# Altium schematic sheet Main.SchDoc: Breakout 12pin
size A3; Organization: INTERCREATE; Address1: 2415 3RD ST. SUITE #232; Address2: SAN FRANCISCO CA 94107; SheetNumber: 1; SheetTotal: 1; ProjectName: KAGWERKS COMMAND CENTER
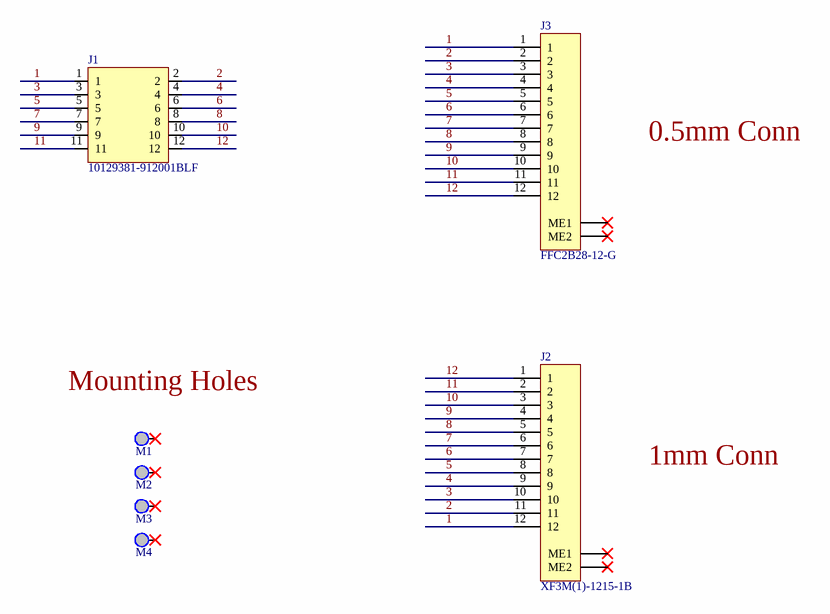
[diagram p0: Main.SchDoc]

## Parts
J1  10129381-912001BLF  [HDR-V-2X6-2.54MM]
J2  XF3M(1)-1215-1B  [CONN-FFC-H-12P-1MM]
J3  FFC2B28-12-G  [CONN-FFC-H-12P-0.5MM]
M1  MTG_HOLE  [MH_P_2.5MM]  (value not drawn)  (no BOM)
M2  MTG_HOLE  [MH_P_2.5MM]  (value not drawn)  (no BOM)
M3  MTG_HOLE  [MH_P_2.5MM]  (value not drawn)  (no BOM)
M4  MTG_HOLE  [MH_P_2.5MM]  (value not drawn)  (no BOM)

## Nets
1: J1.1 J2.12 J3.1
2: J1.2 J2.11 J3.2
3: J1.3 J2.10 J3.3
4: J1.4 J2.9 J3.4
5: J1.5 J2.8 J3.5
6: J1.6 J2.7 J3.6
7: J1.7 J2.6 J3.7
8: J1.8 J2.5 J3.8
9: J1.9 J2.4 J3.9
10: J1.10 J2.3 J3.10
11: J1.11 J2.2 J3.11
12: J1.12 J2.1 J3.12

Not connected (* = marked no-connect by the designer): J2 ME1* ME2*; J3 ME1* ME2*; M1 1*; M2 1*; M3 1*; M4 1*

## Notes on the sheet
- 0.5mm Conn
- (near M1) Mounting Holes
- 1mm Conn
- Title
- Size:
- Date:
- A3
- Number:
- Time:
- Revision:
- Sheet
- of
- File:

## Library data of the parts
J1 = HDR-V-2X6-M-2.54MM: Conn Unshrouded Header HDR 12 POS 2.54mm Solder ST Thru-Hole Poly Bag; Manufacturer 1: Amphenol ICC / FCI; Supplier: Arrow Electronics; Supplier Part Number: 10129381-912001BLF; Manufacturer Part Number 1: 10129381-912001BLF; RoHS: No; Category: Connectors; Stock: 1680; Pricing: 1=0.15, 10=0.1167, 25=0.1155, 50=0.1143, 100=0.0928, 500=0.0794 (USD)
J2 = CONN-FFC-H-12P-1MM: FFC & FPC Connectors RotaryBackLock 1.0mm Dual Contact 12pin; Manufacturer 1: Omron; Actuator Material: Polymer,Liquid Crystal Polymer; Actuator Color: Black; Voltage Rating: 50V; Current Rating: 500mA; Number of Positions: 12; Insulation Resistance: 100MR; Mating Cycles: 20; Pitch: 1mm; Supplier: Digi-Key; Supplier Part Number: OR1212CT-ND; Manufacturer Part Number 1: XF3M(1)-1215-1B; RoHS: Yes; Category: FFC / FPC; Stock: 181; Pricing: 1=1.62, 10=1.406, 25=1.3464, 50=1.3166, 100=1.2567, 250=1.137, 500=1.04724 (USD); Mounting Technology: Surface Mount; Contact Material: Copper Alloy; Contact Plating: Gold; Housing Material: Polymer; Housing Color: Natural; Min Operating Temperature: -30°C; Max Operating Temperature: 85°C; Packaging: Tape and Reel; Number of Rows: 1; Termination: Solder; Orientation: Right Angle; Series: XF3M; Package Quantity: 1500; Contact Location: Dual; Flammability Rating: UL94 V-0; RoHS Compliant: Yes; ComponentLink1URL: https://datasheet.ciiva.com/24242/xf3m-0813-272395-24242220.pdf?src-supplier=Mouser; ComponentLink1Description: https://datasheet.ciiva.com/24242/xf3m-0813-272395-24242220.pdf?src-supplier=Mouser; ComponentLink2URL: https://datasheet.ciiva.com/48563/en-xf3m-48563820.pdf?src-supplier=Avnet; ComponentLink2Description: https://datasheet.ciiva.com/48563/en-xf3m-48563820.pdf?src-supplier=Avnet; ComponentLink3URL: https://datasheet.ciiva.com/29758/xf3m-0813-29758631.pdf?src-supplier=Digi-Key; ComponentLink3Description: https://datasheet.ciiva.com/29758/xf3m-0813-29758631.pdf?src-supplier=Digi-Key; ComponentLink4URL: https://datasheet.ciiva.com/29758/xf3m-0813-29758637.pdf?src-supplier=Digi-Key; ComponentLink4Description: https://datasheet.ciiva.com/29758/xf3m-0813-29758637.pdf?src-supplier=Digi-Key
J3 = CONN-FFC-H-12P-0.5MM: CONN, FPC, 12POS, 1ROW, 0.5MM, R/A SMT; Pitch Spacing: 0.5mm; No. of Contacts: 12Contacts; Gender: Receptacle;...; Manufacturer 1: Global Connector Technology; Supplier: Newark; Supplier Part Number: 90AJ6010; Manufacturer Part Number 1: FFC2B28-12-G; RoHS: No; Category: Connectors; Stock: 3990; Pricing: 1=0.534, 250=0.411, 500=0.37, 1000=0.337, 4000=0.337, 5000=0.309 (USD)
M1-M4 = MTG_HOLE: MTG HOLE PLATED VARIOUS SIZES